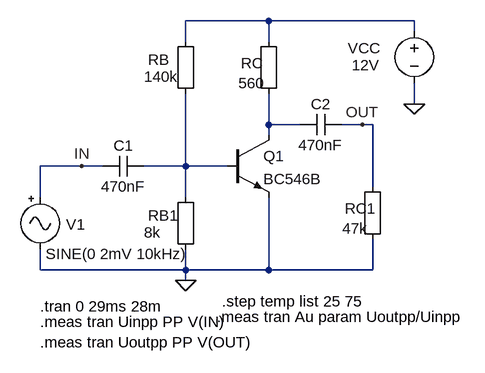
[diagram p0: schematic BT-CE-AMP-1.asc]
BT-CE-AMP-1.asc, the LTspice schematic file:
Version 4
SHEET 1 880 680
WIRE 192 -64 64 -64
WIRE 416 -64 192 -64
WIRE 416 -48 416 -64
WIRE 64 -32 64 -64
WIRE 192 -32 192 -64
WIRE 416 64 416 32
WIRE 192 96 192 48
WIRE 240 96 192 96
WIRE 336 96 304 96
WIRE 352 96 336 96
WIRE 192 112 192 96
WIRE -96 160 -160 160
WIRE -64 160 -96 160
WIRE 64 160 64 48
WIRE 64 160 0 160
WIRE 128 160 64 160
WIRE 352 192 352 96
WIRE -160 208 -160 160
WIRE 64 208 64 160
WIRE -160 320 -160 288
WIRE 64 320 64 288
WIRE 64 320 -160 320
WIRE 192 320 192 208
WIRE 192 320 64 320
WIRE 352 320 352 272
WIRE 352 320 192 320
WIRE 64 336 64 320
FLAG 416 64 0
FLAG -96 160 IN
FLAG 336 96 OUT
FLAG 64 336 0
SYMBOL npn 128 112 R0
SYMATTR InstName Q1
SYMATTR Value BC546B
SYMBOL Misc\\EuropeanResistor 48 -48 R0
WINDOW 0 -42 44 Left 2
WINDOW 3 -48 70 Left 2
SYMATTR InstName RB
SYMATTR Value 140k
SYMBOL Misc\\EuropeanResistor 176 -48 R0
WINDOW 0 -27 49 Left 2
WINDOW 3 -31 80 Left 2
SYMATTR InstName RC
SYMATTR Value 560
SYMBOL Misc\\signal -160 192 R0
WINDOW 123 0 0 Left 2
WINDOW 0 40 58 Left 2
WINDOW 3 8 103 Left 2
WINDOW 39 0 0 Left 0
SYMATTR InstName V1
SYMATTR Value SINE(0 2mV 10kHz)
SYMBOL voltage 416 -64 R0
WINDOW 0 -102 42 Left 2
WINDOW 3 -96 68 Left 2
WINDOW 123 0 0 Left 2
WINDOW 39 0 0 Left 2
SYMATTR InstName VCC
SYMATTR Value 12V
SYMBOL cap 0 144 R90
WINDOW 0 0 32 VBottom 2
WINDOW 3 32 32 VTop 2
SYMATTR InstName C1
SYMATTR Value 470nF
SYMBOL cap 304 80 R90
WINDOW 0 0 32 VBottom 2
WINDOW 3 32 32 VTop 2
SYMATTR InstName C2
SYMATTR Value 470nF
SYMBOL Misc\\EuropeanResistor 48 192 R0
WINDOW 0 -42 44 Left 2
WINDOW 3 -48 70 Left 2
SYMATTR InstName RB1
SYMATTR Value 8k
SYMBOL Misc\\EuropeanResistor 336 176 R0
WINDOW 0 -27 49 Left 2
WINDOW 3 -31 80 Left 2
SYMATTR InstName RC1
SYMATTR Value 47k
TEXT -160 376 Left 2 !.tran 0 29ms 28m
TEXT -160 400 Left 2 !.meas tran Uinpp PP V(IN)\n.meas tran Uoutpp PP V(OUT)
TEXT 112 392 Left 2 !.meas tran Au param Uoutpp/Uinpp
TEXT 120 368 Left 2 !.step temp list 25 75

The netlist it stands for:
* BT-CE-AMP-1.asc
Q1 N002 N003 0 0 BC546B
RB N001 N003 140k
RC N001 N002 560
V1 IN 0 SINE(0 2mV 10kHz)
VCC N001 0 12V
C1 N003 IN 470nF
C2 OUT N002 470nF
RB1 N003 0 8k
RC1 OUT 0 47k
.model NPN NPN
.model PNP PNP
.lib standard.bjt
.tran 0 29ms 28m
.meas tran Uinpp PP V(IN)
.meas tran Uoutpp PP V(OUT)
.meas tran Au param Uoutpp/Uinpp
.step temp list 25 75
.backanno
.end